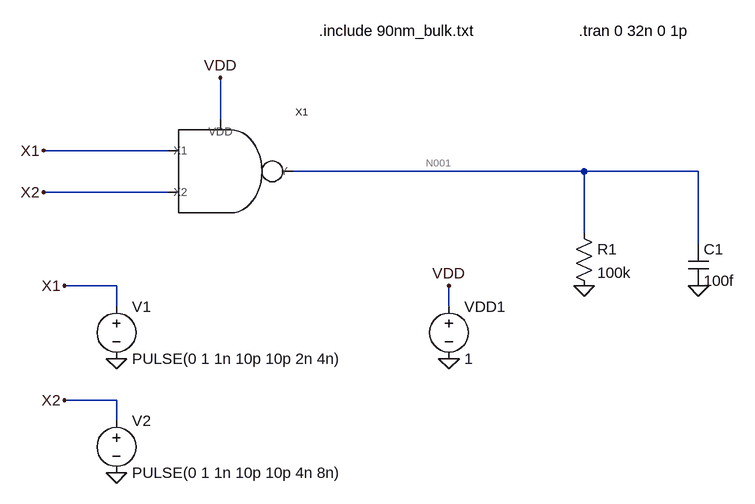
[diagram p0: schematic nand-sym-test.asc]
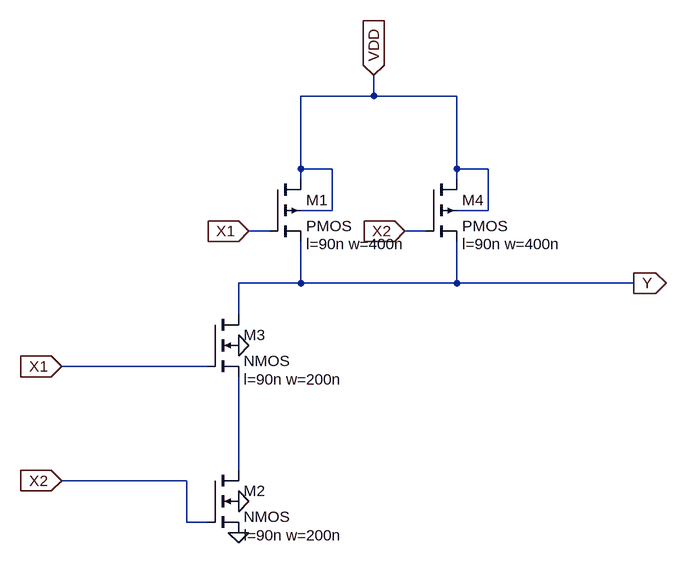
[diagram p1: sub-circuit nand.asc]
nand-sym-test.asc, the LTspice schematic file:
Version 4
SHEET 1 1136 852
WIRE 208 80 208 16
WIRE 128 128 -64 128
WIRE 768 160 320 160
WIRE 944 160 768 160
WIRE 128 192 -64 192
WIRE 768 256 768 160
WIRE 944 272 944 160
WIRE 48 336 -32 336
WIRE 48 368 48 336
WIRE 560 368 560 336
WIRE 48 512 -32 512
WIRE 48 544 48 512
FLAG 48 448 0
FLAG 48 624 0
FLAG -32 336 X1
FLAG -32 512 X2
FLAG -64 128 X1
FLAG -64 192 X2
FLAG 560 448 0
FLAG 560 336 VDD
FLAG 208 16 VDD
FLAG 768 336 0
FLAG 944 336 0
SYMBOL voltage 48 352 R0
WINDOW 123 0 0 Left 0
WINDOW 39 0 0 Left 0
SYMATTR InstName V1
SYMATTR Value PULSE(0 1 1n 10p 10p 2n 4n)
SYMBOL voltage 560 352 R0
WINDOW 123 0 0 Left 0
WINDOW 39 0 0 Left 0
SYMATTR InstName VDD1
SYMATTR Value 1
SYMBOL voltage 48 528 R0
WINDOW 123 0 0 Left 0
WINDOW 39 0 0 Left 0
SYMATTR InstName V2
SYMATTR Value PULSE(0 1 1n 10p 10p 4n 8n)
SYMBOL res 752 240 R0
SYMATTR InstName R1
SYMATTR Value 100k
SYMBOL cap 928 272 R0
SYMATTR InstName C1
SYMATTR Value 100f
SYMBOL nand 208 160 R0
SYMATTR InstName X1
TEXT 360 -56 Left 2 !.include 90nm_bulk.txt
TEXT 760 -56 Left 2 !.tran 0 32n 0 1p

nand.asc, the sub-circuit schematic file:
Version 4
SHEET 1 1104 1140
WIRE 272 -16 272 -48
WIRE 272 -16 160 -16
WIRE 400 -16 272 -16
WIRE 160 96 160 -16
WIRE 208 96 160 96
WIRE 400 96 400 -16
WIRE 448 96 400 96
WIRE 160 112 160 96
WIRE 400 112 400 96
WIRE 208 160 208 96
WIRE 208 160 160 160
WIRE 448 160 448 96
WIRE 448 160 400 160
WIRE 112 192 80 192
WIRE 352 192 320 192
WIRE 160 272 160 208
WIRE 160 272 64 272
WIRE 400 272 400 208
WIRE 400 272 160 272
WIRE 672 272 400 272
WIRE 64 320 64 272
WIRE 16 400 -208 400
WIRE 64 560 64 416
WIRE -16 576 -208 576
WIRE -16 640 -16 576
WIRE 16 640 -16 640
FLAG -208 400 X1
IOPIN -208 400 In
FLAG -208 576 X2
IOPIN -208 576 In
FLAG 64 656 0
FLAG 64 608 0
FLAG 272 -48 VDD
IOPIN 272 -48 In
FLAG 80 192 X1
IOPIN 80 192 In
FLAG 320 192 X2
IOPIN 320 192 In
FLAG 672 272 Y
IOPIN 672 272 Out
FLAG 64 368 0
SYMBOL pmos4 112 112 R0
WINDOW 123 56 100 Left 2
SYMATTR Value2 l=90n w=400n
SYMATTR InstName M1
SYMBOL nmos4 16 560 R0
WINDOW 123 56 100 Left 2
SYMATTR Value2 l=90n w=200n
SYMATTR InstName M2
SYMBOL nmos4 16 320 R0
WINDOW 123 56 100 Left 2
SYMATTR Value2 l=90n w=200n
SYMATTR InstName M3
SYMBOL pmos4 352 112 R0
WINDOW 123 56 100 Left 2
SYMATTR Value2 l=90n w=400n
SYMATTR InstName M4

The netlist it stands for:
* nand-sym-test.asc
V1 X1 0 PULSE(0 1 1n 10p 10p 2n 4n)
VDD1 VDD 0 1
V2 X2 0 PULSE(0 1 1n 10p 10p 4n 8n)
R1 N001 0 100k
C1 N001 0 100f
XX1 N001 X1 X2 VDD nand

* block symbol definitions
.subckt nand Y X1 X2 VDD
M1 VDD X1 Y VDD PMOS l=90n w=400n
M2 N001 X2 0 0 NMOS l=90n w=200n
M3 Y X1 N001 0 NMOS l=90n w=200n
M4 VDD X2 Y VDD PMOS l=90n w=400n
.ends nand

.model NMOS NMOS
.model PMOS PMOS
.lib standard.mos
.include 90nm_bulk.txt
.tran 0 32n 0 1p
.backanno
.end

* Results of the author's LTspice run, read from the files saved beside the schematic
* Operating Point, zero values left out:
*   V(vdd) = 1 V
*   V(n001) = 986.3 mV
*   I(R1) = 9.863 µA
*   I(V2) = 2.839 pA
*   I(Vdd1) = -9.863 µA
*   I(V1) = 120.2 pA
*   Ix(x1:Y) = -9.863 µA
*   Ix(x1:X1) = -120.2 pA
*   Ix(x1:X2) = -2.839 pA
*   Ix(x1:VDD) = 9.863 µA
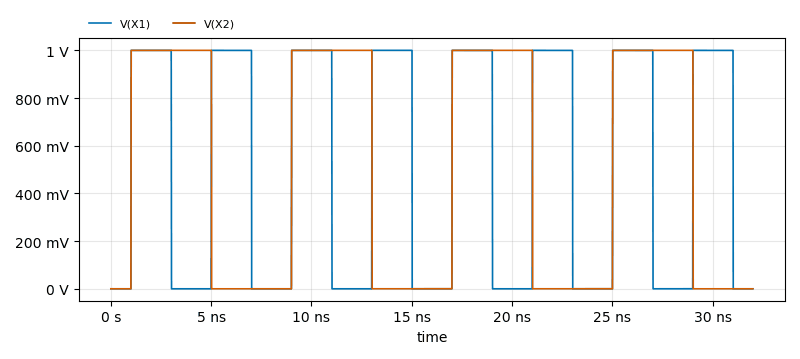
[diagram p2: Transient Analysis of nand-sym-test.asc, plotted from the saved traces]
* Transient Analysis, 1 run:
*   V(X1): min 0 V, max 1 V, average 502.5 mV, rms 708.3 mV, last 0 V
*   V(X2): min 0 V, max 1 V, average 501.2 mV, rms 707.7 mV, last 0 V